# EAGLE design untitled (EAGLE 7.6.0)
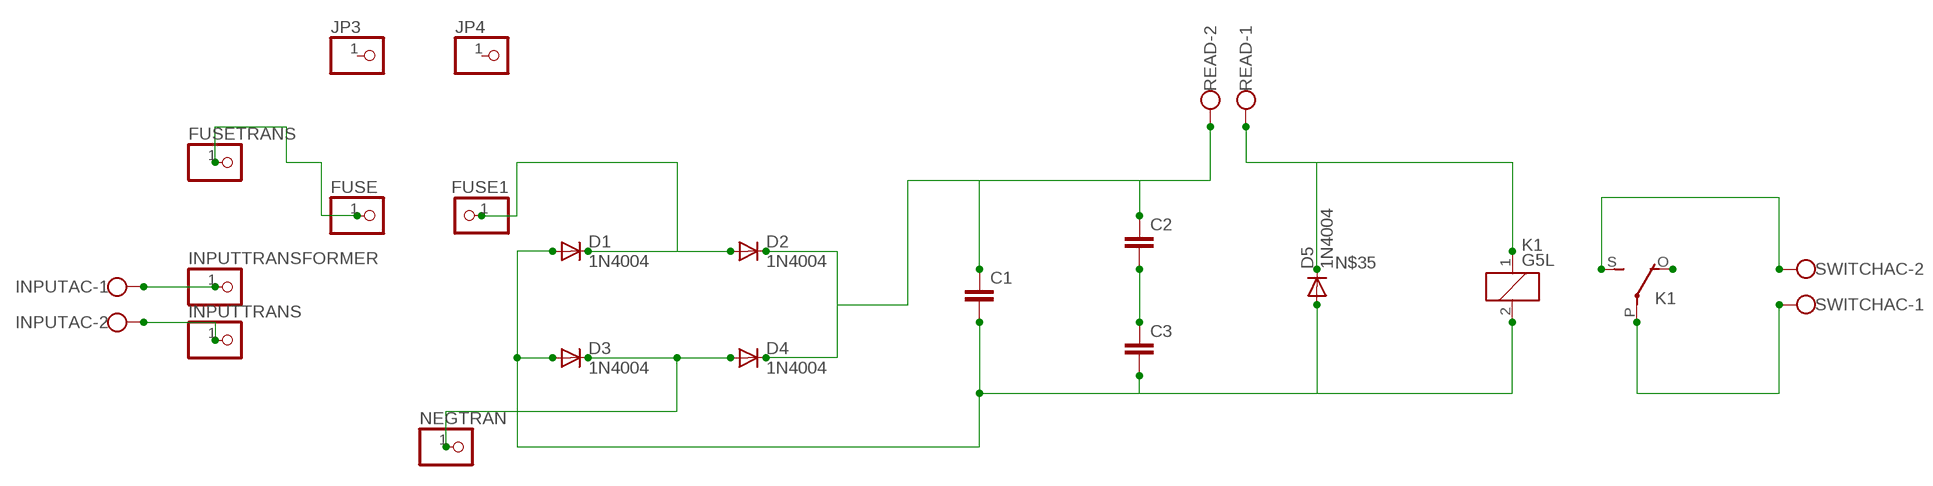
[diagram p0: schematic, sheet 1]

## Parts
C1  CAPACITOR050-075X075  [C050-075X075]
C2  CAPACITOR050-075X075  [C050-075X075]
C3  CAPACITOR050-075X075  [C050-075X075]
D1  1N4004  [DO41-10]
D2  1N4004  [DO41-10]
D3  1N4004  [DO41-10]
D4  1N4004  [DO41-10]
D5  1N4004  [DO41-10]
FUSE  PINHD-1X1  [1X01]
FUSE1  PINHD-1X1  [1X01]
FUSETRANS  PINHD-1X1  [1X01]
INPUTAC  SCREW_TERMINAL_POWER  [POWER_CONNECTOR]
INPUTTRANS  PINHD-1X1  [1X01]
INPUTTRANSFORMER  PINHD-1X1  [1X01]
JP3  PINHD-1X1  [1X01]
JP4  PINHD-1X1  [1X01]
K1  G5L  [G5LE]
NEGTRAN  PINHD-1X1  [1X01]
READ  SCREW_TERMINAL_POWER  [POWER_CONNECTOR]
SWITCHAC  SCREW_TERMINAL_POWER  [POWER_CONNECTOR]

## Nets
N$1: D3.C D4.A NEGTRAN.1
N$2: FUSE.1 FUSETRANS.1
N$3: C1.2 C3.2 D1.A D3.A D5.A K1.2
N$5: D1.C D2.A FUSE1.1
N$6: INPUTAC.1 INPUTTRANSFORMER.1
N$7: INPUTAC.2 INPUTTRANS.1
N$12: C1.1 C2.1 D2.C D4.C READ.2
N$24: K1.O(2:O)
N$25: K1.P(2:P) SWITCHAC.1
N$27: K1.S(2:S) SWITCHAC.2
N$32: C2.2 C3.1
N$35: D5.C K1.1 READ.1
Unconnected: JP3.1 JP4.1

## Library data of the parts
C1-C3 = robocon:CAPACITOR: CAPACITOR, European symbol
D1-D5 = adafruit:1N4004: DIODE General purpose 1N400x type rectifier (With bigger pads) http://www.ladyada.net/library/pcb/eaglelibrary.html
FUSE FUSE1 FUSETRANS INPUTTRANS INPUTTRANSFORMER JP3 JP4 NEGTRAN = adafruit:PINHD-1X1: Pin header 1x1 for 0.1" spacing With round pins
INPUTAC READ SWITCHAC = robocon:SCREW_TERMINAL_POWER: WAGO SCREW CLAMP; MPN: 237-102; OC_FARNELL: unknown; OC_NEWARK: 70K9898
K1 = relay:G5L: RELAY 1 x switch, 10 A/120 V AC, 8 A/30 V ADC, Omron; OC_FARNELL: unknown; OC_NEWARK: unknown

## Net classes
0 default: clearance 0.205 mm

## Board
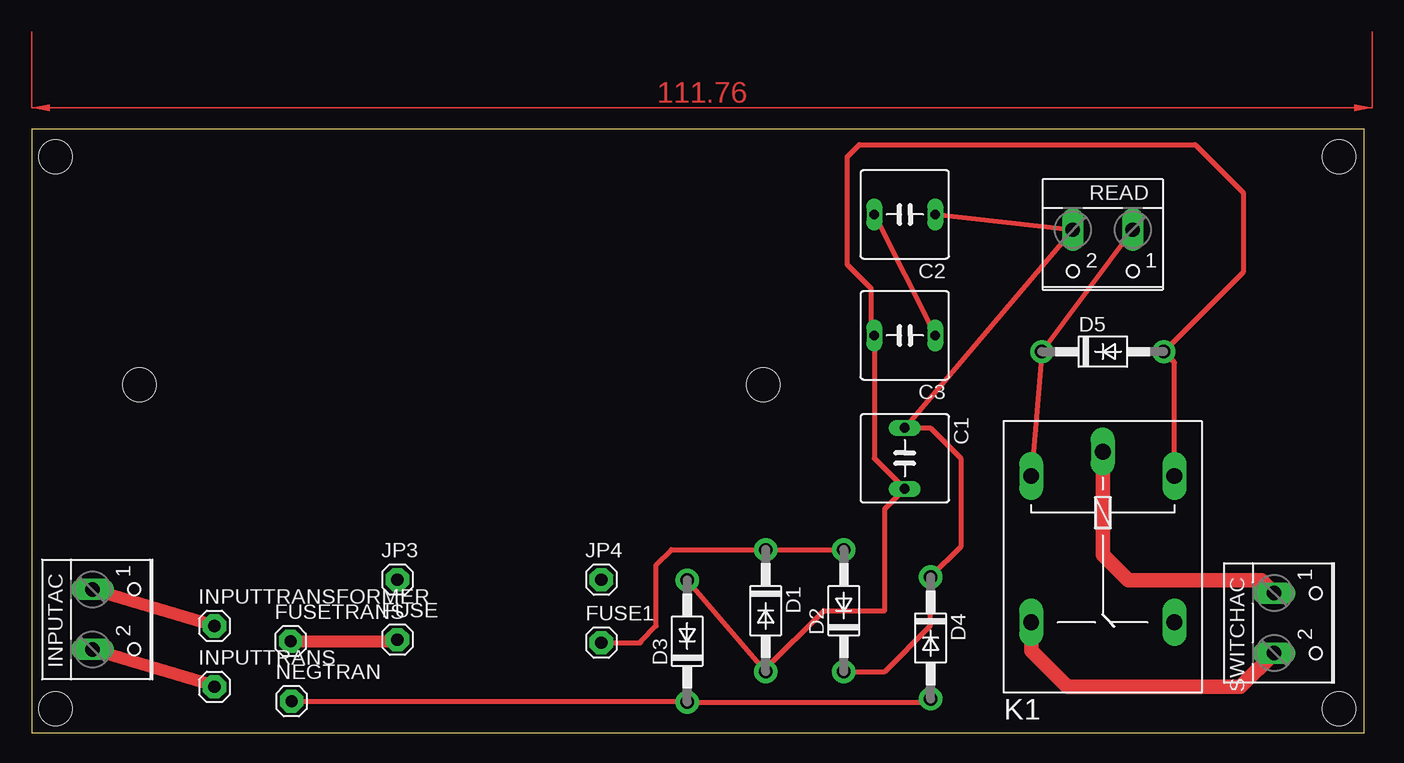
[diagram p1: board, top side]

Size 111.11 x 50.27 mm. Coordinates in mm from the lower left corner, seen from the top.
Outline: 0,0 111.11,0 111.11,50.27 0,50.27 0,0
Copper layers (1*16): Top 0.035mm / dielectric 1.5mm / Bottom 0.035mm
Design rules "default": minimum track width 10mil, minimum drill 24mil, track to track 8mil, track to pad 8mil, pad to pad 8mil, via to via 8mil, smd to smd 8mil, copper to edge 40mil, drill to drill 8mil, minimum pad ring 10mil, minimum via ring 8mil, stop-mask expansion 4mil, vias tented up to drill 0mil, thermal gap 10mil
Holes 2.8 mm at 9,29 61,29 2,48 109,48 109,2 2,2

### Footprints (pad centres in the part's own frame; a part is rotated, then mirrored left to right if it is on the bottom)
C050-075X075 = drill 0.813 long: 1 -2.54,0; 2 2.54,0
DO41-10 = drill 1.118 pad 1.93: A 5.08,0; C -5.08,0
1X01 = drill 1.016 pad 1.93 octagon: 1 0,0
POWER_CONNECTOR = drill 1.194 long: 1 -2.5,-1.27; 2 2.5,-1.27
G5LE = drill 1.321 long: 1 -7.493,-5.969; 2 -7.493,5.969; O 4.699,5.969; P -9.525,0; S 4.699,-5.969

### Placement (x,y rotation side)
C1  72.79,22.86 270 top
C2  72.79,43.18 180 top
C3  72.79,33.1 180 top
D1  61.2,10.16 270 top
D2  67.71,10.16 90 top
D3  54.66,7.62 90 top
D4  74.95,7.89 270 top
D5  89.3,31.75 0 top
FUSE  30.5,7.75 0 top
FUSE1  47.5,7.5 0 top
FUSETRANS  21.59,7.62 0 top
INPUTAC  6.35,9.43 270 top
INPUTTRANS  15.24,3.81 0 top
INPUTTRANSFORMER  15.24,8.89 0 top
JP3  30.5,12.75 0 top
JP4  47.5,12.75 0 top
K1  89.3,13.89 270 top
NEGTRAN  21.67,2.62 0 top
READ  89.3,40.64 180 top
SWITCHAC  104.86,9.13 270 top

### Tracks (layer width: path | path; a pad name or v marks a point on that pad's centre or on a via)
N$1
  Top 0.406: NEGTRAN.1 54.66,2.62 D3.C 74.68,2.54 D4.A
N$2
  Top 0.406: 30.5,7.62 FUSE.1
  Top 1: FUSETRANS.1 30.5,7.62
N$3
  Top 0.406: D3.A D1.A 61.2,5.32 66.04,10.16 71.12,10.16 71.12,18.65 C1.2 70.25,22.86 C3.2 70.1,33.1 70,33 70,37 68,39 68,48 69,49 97,49 101,45 101,38.37 D5.A 95.27,30.86 K1.2
N$5
  Top 0.406: D2.A D1.C 53.34,15.24 52.07,13.97 52.07,8.89 50.8,7.62 50.8,7.5 FUSE1.1
N$6
  Top 0.406: 15.24,8.93 INPUTTRANSFORMER.1
  Top 1: INPUTAC.1 15.24,8.93
N$7
  Top 0.406: 15.24,3.93 INPUTTRANS.1
  Top 1: INPUTAC.2 15.24,3.93
N$12
  Top 0.406: D2.C 71.12,5.08 74.93,8.89 74.93,12.95 D4.C 77.47,15.49 77.47,22.86 74.93,25.4 C1.1 READ.2 C2.1
N$25
  Top 1.2: K1.P 89.3,14.84 91.44,12.7 102.52,12.7 SWITCHAC.1
N$27
  Top 1.2: K1.S 83.33,6.84 86.36,3.81 100.77,3.81 SWITCHAC.2
N$32
  Top 0.406: C2.2 C3.1
N$35
  Top 0.406: K1.1 D5.C READ.1
(copper drawn outside any net)
  shapes: Top area x2